# EAGLE design 0129-codec-mp3 (EAGLE 9.6.2)
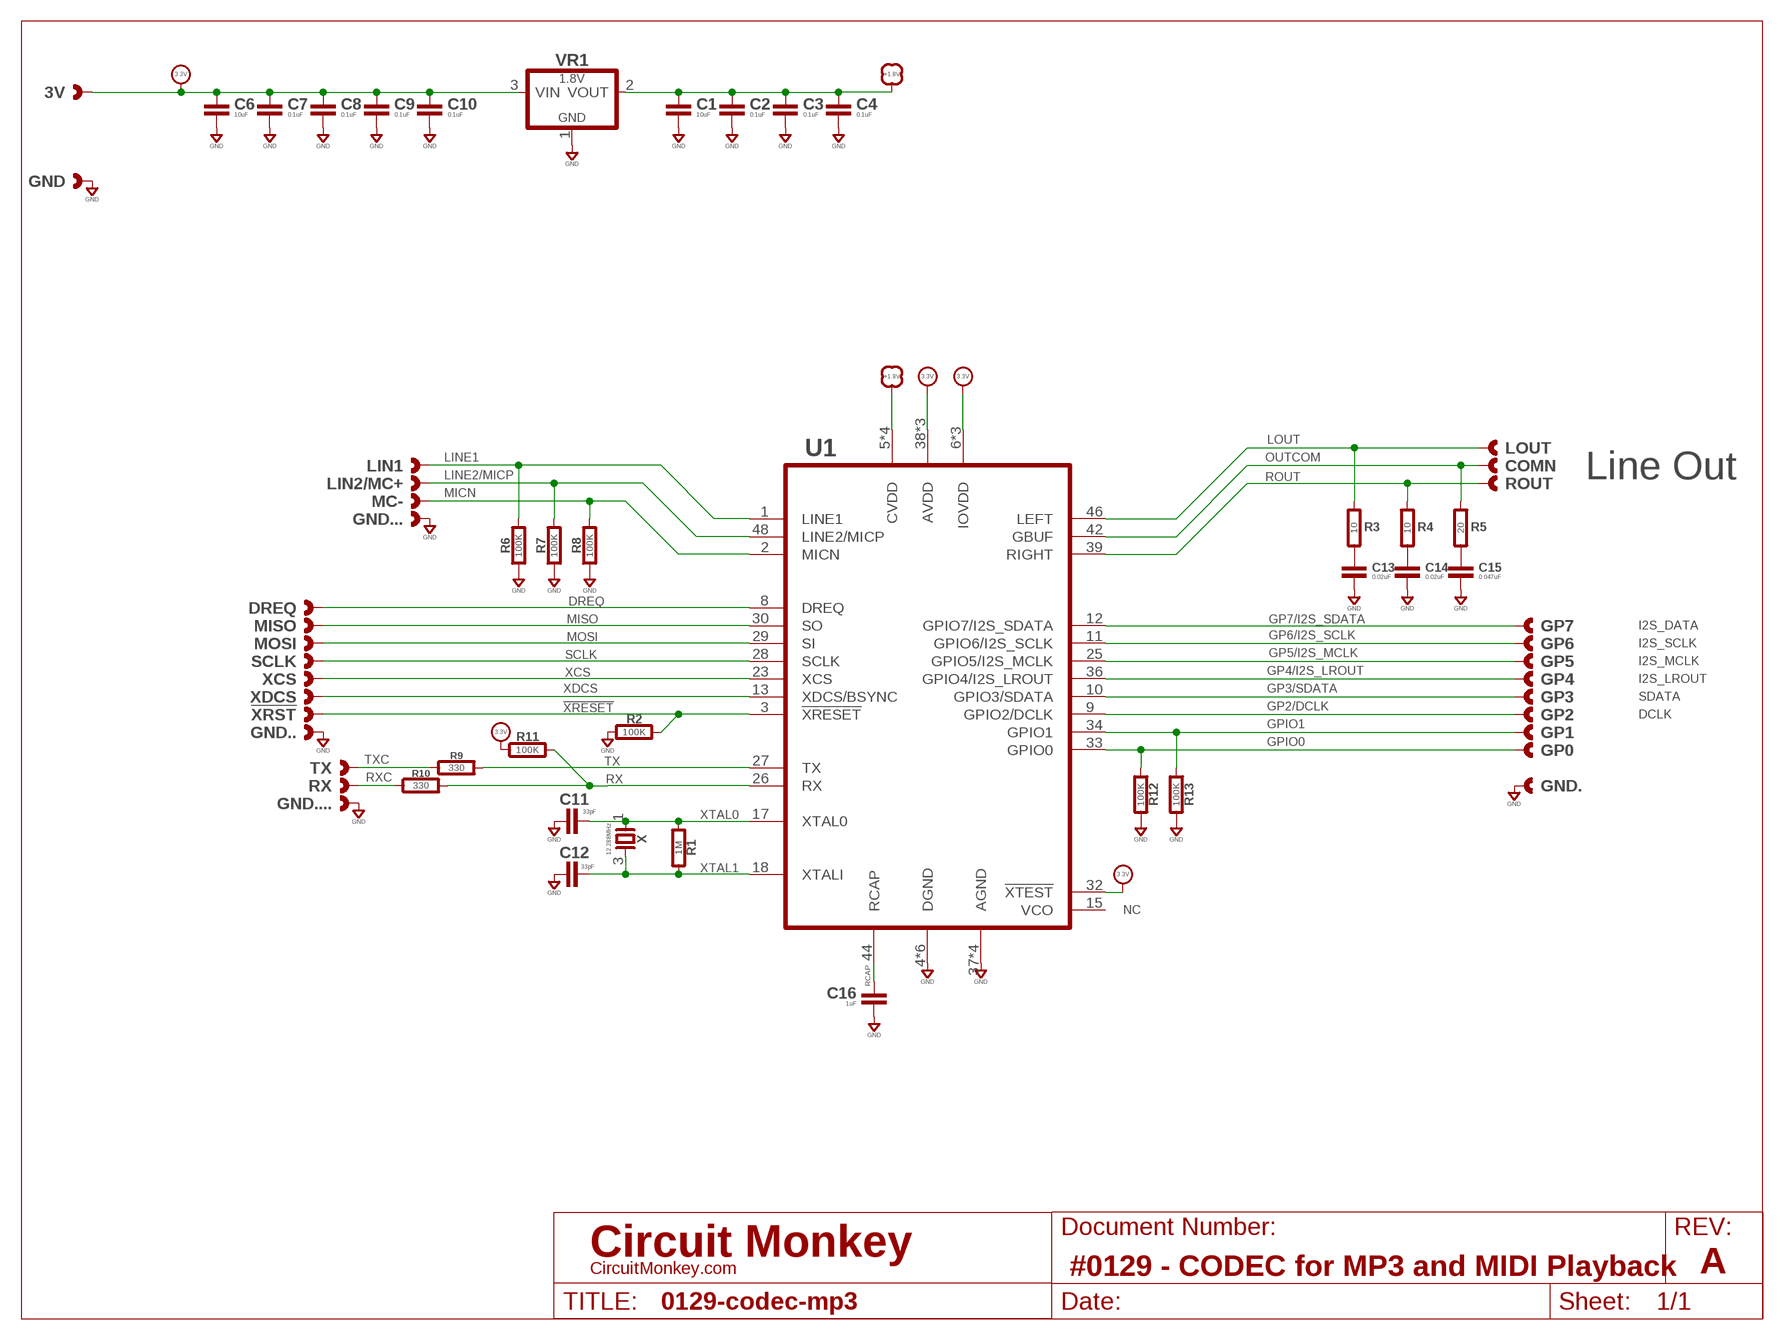
[diagram p0: schematic, sheet 1]
SHEET1 (LETTER_L-CIRCUITMONKEY): DOCUMENT_NUMBER: #0129 - CODEC for MP3 and MIDI Playback; REV: A

## Parts
3V  CAST-01X12.00MM  [CAST01-2.00MM]
!XRST  CAST-01X12.00MM  [CAST01-2.00MM]
C1  10uF  CAPACITOR0603  [0603-CAP]
C2  0.1uF  CAPACITOR0603  [0603-CAP]
C3  0.1uF  CAPACITOR0603  [0603-CAP]
C4  0.1uF  CAPACITOR0603  [0603-CAP]
C6  10uF  CAPACITOR0603  [0603-CAP]
C7  0.1uF  CAPACITOR0603  [0603-CAP]
C8  0.1uF  CAPACITOR0603  [0603-CAP]
C9  0.1uF  CAPACITOR0603  [0603-CAP]
C10  0.1uF  CAPACITOR0603  [0603-CAP]
C11  33pF  CAPACITOR0603  [0603-CAP]
C12  33pF  CAPACITOR0603  [0603-CAP]
C13  0.02uF  CAPACITOR0603  [0603-CAP]
C14  0.02uF  CAPACITOR0603  [0603-CAP]
C15  0.047uF  CAPACITOR0603  [0603-CAP]
C16  1uF  CAPACITOR0603  [0603-CAP]
COMN  CAST-01X12.00MM  [CAST01-2.00MM]
DREQ  CAST-01X12.00MM  [CAST01-2.00MM]
GND  CAST-01X12.00MM  [CAST01-2.00MM]
GND.  CAST-01X12.00MM  [CAST01-2.00MM]
GND..  CAST-01X12.00MM  [CAST01-2.00MM]
GND...  CAST-01X12.00MM  [CAST01-2.00MM]
GND....  CAST-01X12.00MM  [CAST01-2.00MM]
GP0  CAST-01X12.00MM  [CAST01-2.00MM]
GP1  CAST-01X12.00MM  [CAST01-2.00MM]
GP2  CAST-01X12.00MM  [CAST01-2.00MM]
GP3  CAST-01X12.00MM  [CAST01-2.00MM]
GP4  CAST-01X12.00MM  [CAST01-2.00MM]
GP5  CAST-01X12.00MM  [CAST01-2.00MM]
GP6  CAST-01X12.00MM  [CAST01-2.00MM]
GP7  CAST-01X12.00MM  [CAST01-2.00MM]
LIN1  CAST-01X12.00MM  [CAST01-2.00MM]
LIN2/MC+  CAST-01X12.00MM  [CAST01-2.00MM]
LOUT  CAST-01X12.00MM  [CAST01-2.00MM]
MC-  CAST-01X12.00MM  [CAST01-2.00MM]
MISO  CAST-01X12.00MM  [CAST01-2.00MM]
MOSI  CAST-01X12.00MM  [CAST01-2.00MM]
R1  1M  RESISTOR0603  [0603-RES]
R2  100K  RESISTOR0603  [0603-RES]
R3  10  RESISTOR0603  [0603-RES]
R4  10  RESISTOR0603  [0603-RES]
R5  20  RESISTOR0603  [0603-RES]
R6  100K  RESISTOR0603  [0603-RES]
R7  100K  RESISTOR0603  [0603-RES]
R8  100K  RESISTOR0603  [0603-RES]
R9  330  RESISTOR0603  [0603-RES]
R10  330  RESISTOR0603  [0603-RES]
R11  100K  RESISTOR0603  [0603-RES]
R12  100K  RESISTOR0603  [0603-RES]
R13  100K  RESISTOR0603  [0603-RES]
ROUT  CAST-01X12.00MM  [CAST01-2.00MM]
RX  CAST-01X12.00MM  [CAST01-2.00MM]
SCLK  CAST-01X12.00MM  [CAST01-2.00MM]
TX  CAST-01X12.00MM  [CAST01-2.00MM]
U1  CODEC-VS1053  [LQFP-48]
VR1  1.8V  LDO-3P--1.8V-SOT23  [SOT-23]
X  12.288MHz  2P32X25-12.288MHZ  [32X25]
XCS  CAST-01X12.00MM  [CAST01-2.00MM]
XDCS  CAST-01X12.00MM  [CAST01-2.00MM]

## Nets
!XRESET: !XRST.1 !XRST.P$1 !XRST.P$2 R2.2 U1.3(!XRESET)
+1.8V: C1.1 C2.1 C3.1 C4.1 U1.5(CVDD) U1.7(CVDD) U1.24(CVDD) U1.31(CVDD) VR1.2(VOUT)
+3.3V: 3V.1 3V.P$1 3V.P$2 C6.1 C7.1 C8.1 C9.1 C10.1 R11.1 U1.6(IOVDD) U1.14(IOVDD) U1.19(IOVDD) U1.32(!XTEST) U1.38(AVDD) U1.43(AVDD) U1.45(AVDD) VR1.3(VIN) ; supply symbol labelled 3.3V
DREQ: DREQ.1 DREQ.P$1 DREQ.P$2 U1.8(DREQ)
GND: C1.2 C2.2 C3.2 C4.2 C6.2 C7.2 C8.2 C9.2 C10.2 C11.1 C12.1 C13.2 C14.2 C15.2 C16.2 GND.1 GND..1 GND...1 GND....1 GND.....1 GND.....P$1 GND.....P$2 GND....P$1 GND....P$2 GND...P$1 GND...P$2 GND..P$1 GND..P$2 GND.P$1 GND.P$2 R2.1 R6.1 R7.1 R8.1 R12.2 R13.2 U1.4(DGND) U1.16(DGND) U1.20(DGND) U1.21(DGND) U1.22(DGND) U1.35(DGND) U1.37(AGND) U1.40(AGND) U1.41(AGND) U1.47(AGND) VR1.1(GND)
GP2/DCLK: GP2.1 GP2.P$1 GP2.P$2 U1.9(GPIO2/DCLK)
GP3/SDATA: GP3.1 GP3.P$1 GP3.P$2 U1.10(GPIO3/SDATA)
GP4/I2S_LROUT: GP4.1 GP4.P$1 GP4.P$2 U1.36(GPIO4/I2S_LROUT)
GP5/I2S_MCLK: GP5.1 GP5.P$1 GP5.P$2 U1.25(GPIO5/I2S_MCLK)
GP6/I2S_SCLK: GP6.1 GP6.P$1 GP6.P$2 U1.11(GPIO6/I2S_SCLK)
GP7/I2S_SDATA: GP7.1 GP7.P$1 GP7.P$2 U1.12(GPIO7/I2S_SDATA)
GPIO0: GP0.1 GP0.P$1 GP0.P$2 R12.1 U1.33(GPIO0)
GPIO1: GP1.1 GP1.P$1 GP1.P$2 R13.1 U1.34(GPIO1)
LINE1: LIN1.1 LIN1.P$1 LIN1.P$2 R6.2 U1.1(LINE1)
LINE2/MICP: LIN2/MC+.1 LIN2/MC+.P$1 LIN2/MC+.P$2 R7.2 U1.48(LINE2/MICP)
LOUT: LOUT.1 LOUT.P$1 LOUT.P$2 R3.1 U1.46(LEFT)
MICN: MC-.1 MC-.P$1 MC-.P$2 R8.2 U1.2(MICN)
MISO: MISO.1 MISO.P$1 MISO.P$2 U1.30(SO)
MOSI: MOSI.1 MOSI.P$1 MOSI.P$2 U1.29(SI)
N$3: C13.1 R3.2
N$4: C14.1 R4.2
N$5: C15.1 R5.2
OUTCOM: COMN.1 COMN.P$1 COMN.P$2 R5.1 U1.42(GBUF)
RCAP: C16.1 U1.44(RCAP)
ROUT: R4.1 ROUT.1 ROUT.P$1 ROUT.P$2 U1.39(RIGHT)
RX: R10.2 R11.2 U1.26(RX)
RXC: R10.1 RX.1 RX.P$1 RX.P$2
SCLK: SCLK.1 SCLK.P$1 SCLK.P$2 U1.28(SCLK)
TX: R9.2 U1.27(TX)
TXC: R9.1 TX.1 TX.P$1 TX.P$2
XCS: U1.23(XCS) XCS.1 XCS.P$1 XCS.P$2
XDCS: U1.13(XDCS/BSYNC) XDCS.1 XDCS.P$1 XDCS.P$2
XTAL0: C11.2 R1.1 U1.17(XTAL0) X.1
XTAL1: C12.2 R1.2 U1.18(XTALI) X.3
Unconnected: U1.15(VCO)

## Notes on the sheet
- Line Out
- I2S_DATA
- I2S_SCLK
- I2S_MCLK
- I2S_LROUT
- SDATA
- DCLK
- NC

## Library data of the parts
3V !XRST COMN DREQ GND GND. GND.. GND... GND.... GP0 GP1-GP7 LIN1 LIN2/MC+ LOUT MC- MISO MOSI ROUT RX SCLK TX XCS XDCS = con-headers:CAST-01X1: Castelated Edge Hole Pad
C1-C4 C6-C16 = rlc:CAPACITOR: Capacitor; COST01: 0.12; COST10: 0.09; COST100: 0.05
R1-R13 = rlc:RESISTOR: Resistor; COST01: 0.10; COST10: 0.05; COST100: 0.02
U1 = audio:CODEC-VS1053: VLSI CODEC for OGG,WAV,MP3 Recording/Playback, MIDI Sound Gen. I2S Capable
VR1 = regulators:LDO-3P-: regulator 3-pin; COST01: 0.40; COST10: 0.30; COST100: 0.15; MFR: Diodes, Inc.; MPN: AP2120N-1.8
X = xtal:2P: Crystal; COST01: 0.70; COST10: 0.57; COST100: 0.54; MPN: ABM8G-12.2-18D2Y

## Board
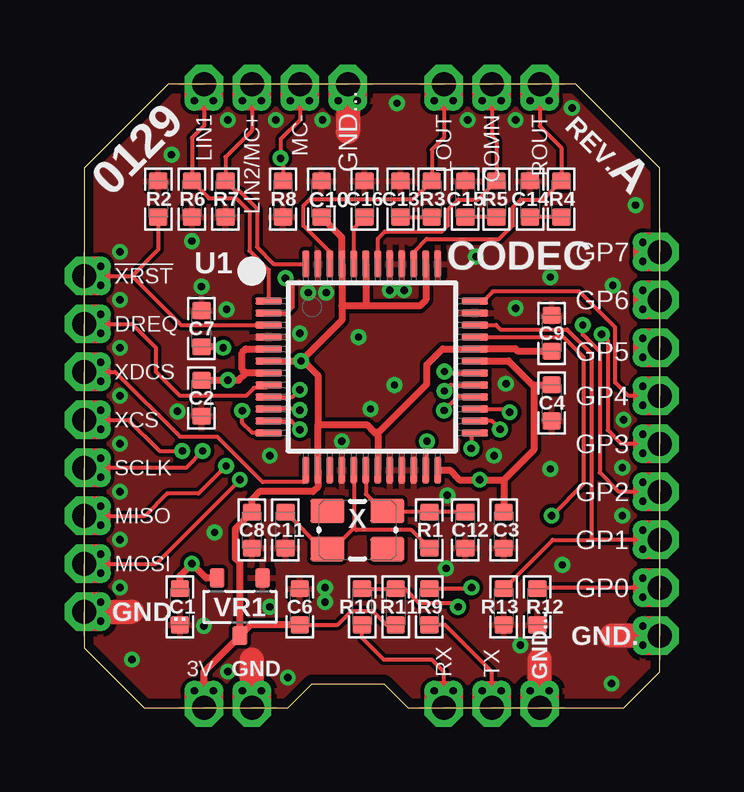
[diagram p1: board, top side]
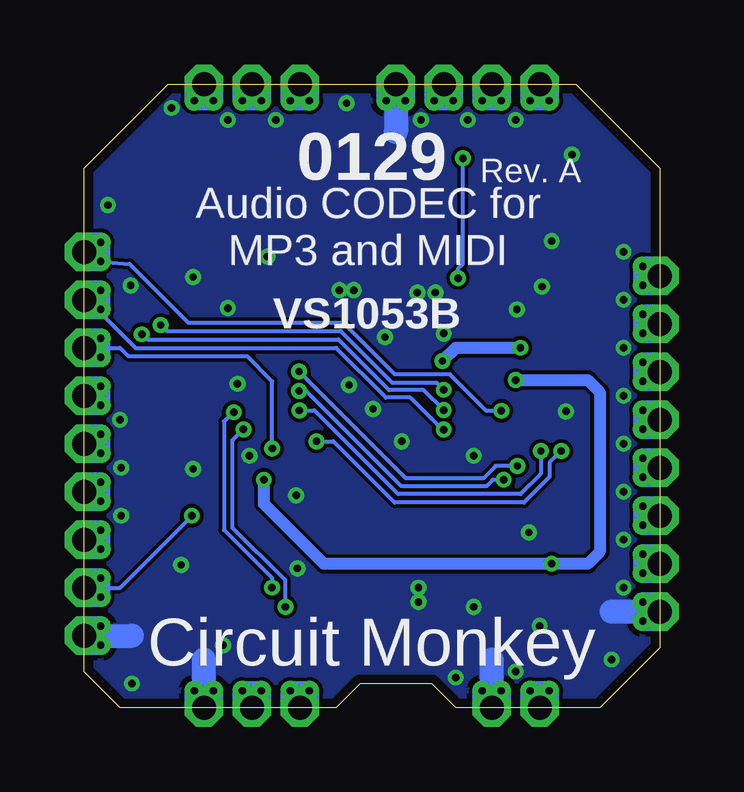
[diagram p2: board, bottom side, seen from below]

Size 24 x 26 mm. Coordinates in mm from the lower left corner, seen from the top.
Outline: 2.5,0 8.5,0 9.5,1 12.5,1 13.5,0 22.5,0 24,1.5 24,22.5 20.5,26 3.5,26 0,22.5 0,2.5 2.5,0
Copper layers (1*16): Top 0.0712mm / dielectric 0.657mm / Bottom 0.0712mm
Design rules "OSH-CircuitMonkey-thin": minimum track width 6mil, minimum drill 12mil, track to track 6mil, track to pad 6mil, pad to pad 6mil, via to via 6mil, smd to smd 6mil, copper to edge 15mil, drill to drill 6mil, minimum pad ring 7mil, minimum via ring 7mil, stop-mask expansion 3mil, vias tented up to drill 14mil, thermal gap 10mil

### Footprints (pad centres in the part's own frame; a part is rotated, then mirrored left to right if it is on the bottom)
CAST01-2.00MM = drill 1 pad 1.6 octagon: 1 0,0 | drill 0.305 pad 0.813: P$1 -0.7,0.4; P$2 -0.7,-0.4
0603-CAP = smd 0.711 x 0.762: 1 -0.752,0; 2 0.752,0
0603-RES = smd 0.711 x 0.762: 1 -0.752,0; 2 0.752,0
LQFP-48 = smd 1.1 x 0.3: 1 -4.3,2.75; 2 -4.3,2.25; 3 -4.3,1.75; 4 -4.3,1.25; 5 -4.3,0.75; 6 -4.3,0.25; 7 -4.3,-0.25; 8 -4.3,-0.75; 9 -4.3,-1.25; 10 -4.3,-1.75; 11 -4.3,-2.25; 12 -4.3,-2.75; 25 4.3,-2.75; 26 4.3,-2.25; 27 4.3,-1.75; 28 4.3,-1.25; 29 4.3,-0.75; 30 4.3,-0.25; 31 4.3,0.25; 32 4.3,0.75; 33 4.3,1.25; 34 4.3,1.75; 35 4.3,2.25; 36 4.3,2.75 | smd 0.3 x 1.1: 13 -2.75,-4.3; 14 -2.25,-4.3; 15 -1.75,-4.3; 16 -1.25,-4.3; 17 -0.75,-4.3; 18 -0.25,-4.3; 19 0.25,-4.3; 20 0.75,-4.3; 21 1.25,-4.3; 22 1.75,-4.3; 23 2.25,-4.3; 24 2.75,-4.3; 37 2.75,4.3; 38 2.25,4.3; 39 1.75,4.3; 40 1.25,4.3; 41 0.75,4.3; 42 0.25,4.3; 43 -0.25,4.3; 44 -0.75,4.3; 45 -1.25,4.3; 46 -1.75,4.3; 47 -2.25,4.3; 48 -2.75,4.3
SOT-23 = smd 0.6 x 0.8: 1 0.95,1.2; 2 -0.95,1.2; 3 0,-1.2
32X25 = smd 1.4 x 1: 1 -1.25,-0.8; 2 1.25,-0.8; 3 1.25,0.8; 4 -1.25,0.8

### Placement (x,y rotation side)
3V  5,0 270 top
!XRST  0,18 180 top
C1  4,4.2 270 top
C2  4.9,12.9 270 top
C3  17.5,7.4 270 top
C4  19.5,12.7 270 top
C6  9,4.2 90 top
C7  4.9,15.8 90 top
C8  7,7.4 270 top
C9  19.5,15.6 90 top
C10  9.9,21.2 90 top
C11  8.4,7.4 90 top
C12  15.9,7.4 90 top
C13  13.2,21.2 90 top
C14  18.6,21.2 90 top
C15  15.9,21.2 90 top
C16  11.7,21.2 90 top
COMN  17,26 90 top
DREQ  0,16 180 top
GND  7,0 270 top
GND.  24,3 0 top
GND..  0,4 180 top
GND...  11,26 90 top
GND....  19,0 270 top
GP0  24,5 0 top
GP1  24,7 0 top
GP2  24,9 0 top
GP3  24,11 0 top
GP4  24,13 0 top
GP5  24,15 0 top
GP6  24,17 0 top
GP7  24,19 0 top
LIN1  5,26 90 top
LIN2/MC+  7,26 90 top
LOUT  15,26 90 top
MC-  9,26 90 top
MISO  0,8 180 top
MOSI  0,6 180 top
R1  14.4,7.4 90 top
R2  3.1,21.2 270 top
R3  14.5,21.2 270 top
R4  19.9,21.2 270 top
R5  17.2,21.2 270 top
R6  4.5,21.2 90 top
R7  5.9,21.2 90 top
R8  8.3,21.2 90 top
R9  14.4,4.2 90 top
R10  11.6,4.2 90 top
R11  13,4.2 90 top
R12  18.9,4.2 270 top
R13  17.5,4.2 270 top
ROUT  19,26 90 top
RX  15,0 270 top
SCLK  0,10 180 top
TX  17,0 270 top
U1  12,14.2 0 top
VR1  6.5,4.2 0 top
X  11.4,7.4 0 top
XCS  0,12 180 top
XDCS  0,14 180 top

### Tracks (layer width: path | path; a pad name or v marks a point on that pad's centre or on a via)
!XRESET
  Top 0.16: U1.3 4.05,15.95 2,18 | 2,18 !XRST.1 0.2,18 | 0.2,18 !XRST.P$1 | 0.2,18 !XRST.P$2 | R2.2 3.1,19.1 2,18
+1.8V  (via drill 0.3)
  Top 0.3: U1.7 6.75,13.95 | 6.75,13.95 6.6,14.1 6.6,14.8 6.75,14.95 U1.5 | C2.1 v6,13.65 6.45,13.65 6.75,13.95 | VR1.2 5.1,5.4 v4.5,6 4,5.5 C1.1 | 17.5,9.5 C3.1 | U1.24 15.25,9.9 15.65,9.5 v16.5,9.5 17.5,9.5 | 18.75,13.45 18.7,13.45 17.7,14.45 U1.31 | 18.75,13.45 C4.1 | 17.5,9.5 18.75,10.75 18.75,13.45
  Bottom 0.5: v16.5,9.5 16.5,8.5 14,6 v4.5,6 3,6 2.5,6.5 2.5,13.15 3,13.65 v6,13.65
+3.3V  (via drill 0.3)
  Top 0.16: C6.1 10.58,3.45 11.16,4.04 12.04,4.04 12.62,3.45 R11.1
  Top 0.3: 9.75,11.8 U1.14 9.75,9.21 9.54,9 7.33,9 7,8.67 C8.1 6.32,7.47 6.32,6.21 6.5,6.03 VR1.3 | 9.75,11.8 11.8,11.8 12.1,11.5 | 12.1,11.5 12.25,11.35 U1.19 | U1.6 v9.05,14.45 | 9.75,11.8 9.75,13.85 9.15,14.45 v9.05,14.45 | C7.1 5.75,15.05 v5.8,15 | 10.75,16.75 U1.45 10.75,19.6 C10.1 | 10.75,16.75 10.75,16.15 v9.05,14.45 | 11.75,16.75 10.75,16.75 | 12.1,11.5 12.3,11.5 14.3,13.5 14.3,14.3 14.95,14.95 U1.32 17.99,14.95 18.09,14.85 C9.1 | U1.38 14.25,17 14,16.75 11.75,16.75 | U1.43 11.75,16.75 | VR1.3 5,1.5 3V.1 5,0.2 | 5,0.2 3V.P$1 | 5,0.2 3V.P$2 | C6.1 6.95,3.45 VR1.3
  Bottom 0.5: v5.8,15 8.5,15 v9.05,14.45
DREQ
  Top 0.16: U1.8 7.58,13.33 7.09,13.33 6.76,13 4,13 3,14 3,15 2,16 DREQ.1 0.2,16 | 0.2,16 DREQ.P$2 | 0.2,16 DREQ.P$1
GND  (via drill 0.3)
  Top 0.16: GND.....1 19,0.2 GND.....P$1 GND.....P$2 | 7,0.2 GND.P$1 | GND.1 7,0.2 | 7,0.2 GND.P$2
  Top 1: GND.1 7,2 | GND.....1 19,2 | GND..1 22,3 | GND...1 2,4 | GND....1 11,24
  Bottom 0.16: 23.8,3 GND..P$1 | GND..1 23.8,3 | 23.8,3 GND..P$2 | GND...P$2 0.5,4.5 GND...1 0.5,3.5 GND...P$1 | GND....P$2 11.5,25.5 GND....1 11,25.8 GND....P$1
  Bottom 1: GND.1 7,2 | GND.....1 19,2 | GND..1 22,3 | GND...1 2,4 | GND....1 11,24
  other vias: 2,2 5.45,7.3 10.05,5 22,1 19.95,5.95 22.45,8 22.45,10 22.5,12 23,20.95 19.45,9.95 11.95,12.45 12.95,13.45 11.45,15.45 16.35,18.8 19.45,17.95 3.65,23.05 6,24.5 8,24.5 9.95,24.5 16,24.5 18,24.5 20.35,25 13.05,25.2 18,16.65 17.6,13.5 17.1,10.5 12.75,17.4 13.35,17.4 10.1,17.3 9.35,17.3 9,15.6 1.5,17 1.5,15 5.95,16.6 4.9,17.55 4.5,19.45 1.5,13 1.5,11 1.5,9 1.5,7 10.75,11.1 15.1,5.8 15.15,8.85 1.5,19 1.5,5 18.2,2.6 10.05,4.4 7.75,4.2 5,3.4 6,1.5 8.5,1.25 7.75,10.5 3.9,12.35 22.05,17.6
  pour Top: 2.5,0 0,2.5 0,22.5 3.5,26 20.5,26 24,22.5 24,1.5 22.5,0 13.5,0 12.5,1 9.5,1 8.5,0
  pour Bottom: 22.5,0 24,1.5 24,22.5 20.5,26 3.5,26 0,22.5 0,2.5 2.5,0 8.5,0 9.5,1 12.5,1 13.5,0
GP2/DCLK  (via drill 0.3)
  Top 0.16: U1.9 8.7,12.95 v9,13.25 | GP2.1 22.3,9 21.5,9.8 21.5,14.85 20.8,15.55 v20.8,15.95
  Bottom 0.16: v9,13.25 9.3,13.55 11.15,13.55 13.3,15.7 20.55,15.7 v20.8,15.95 | 23.8,9 GP2.P$1 | GP2.1 23.8,9 | 23.8,9 GP2.P$2
GP3/SDATA  (via drill 0.3)
  Top 0.16: U1.10 8.95,12.45 v9,12.4 | GP3.1 22.4,11 21.84,11.56 21.84,15.31 v21.59,15.56
  Bottom 0.16: 23.8,11 GP3.P$1 | GP3.1 23.8,11 | 23.8,11 GP3.P$2 | v9,12.4 9.84,13.24 11.28,13.24 13.39,15.35 21.38,15.35 v21.59,15.56
GP4/I2S_LROUT
  Top 0.16: U1.36 16.65,16.95 17.05,17.35 20.65,17.35 22.15,15.85 22.15,13.55 22.7,13 GP4.1
  Bottom 0.16: 23.8,13 GP4.P$1 | GP4.1 23.8,13 | 23.8,13 GP4.P$2
GP5/I2S_MCLK  (via drill 0.3)
  Top 0.16: U1.25 16.15,11.3 v16.15,10.8
  Bottom 0.16: v16.15,10.8 16.15,13.6 17.2,14.65 22.15,14.65 22.5,15 GP5.1 23.8,15 | 23.8,15 GP5.P$1 | 23.8,15 GP5.P$2
GP6/I2S_SCLK  (via drill 0.3)
  Top 0.16: U1.11 8.64,11.95 v9,11.59
  Bottom 0.16: 23.8,17 GP6.P$1 | 23.8,17 GP6.1 23.85,17 21.85,15 13.48,15 11.41,12.93 10.39,12.93 9.05,11.59 v9,11.59 | 23.8,17 GP6.P$2
GP7/I2S_SDATA  (via drill 0.3)
  Top 0.16: U1.12 7.02,11.45 6.6,11.87 v6.6,12.37
  Bottom 0.16: 23.8,19 GP7.P$2 22.1,18.5 19.65,16.05 13.2,16.05 11.03,13.89 8.74,13.89 7.22,12.37 v6.6,12.37 | GP7.1 23.8,19 | 23.8,19 GP7.P$1
GPIO0  (via drill 0.3)
  Top 0.16: R12.1 18.95,5 GP0.1 23.8,5 | 23.8,5 GP0.P$1 | 23.8,5 GP0.P$2 | v19.5,8 20.84,9.34 20.84,14.6 19.99,15.45 U1.33
  Bottom 0.16: GP0.1 22.5,5 v19.5,8
GPIO1
  Top 0.16: R13.1 19.55,7 21.15,7 | 21.15,7 GP1.1 23.8,7 | 23.8,7 GP1.P$1 | 23.8,7 GP1.P$2 | U1.34 17.18,15.95 17.36,15.76 20.14,15.76 21.15,14.75 21.15,7
LINE1
  Top 0.16: U1.1 7.7,18.25 6.9,19.05 6.9,20.67 6.34,21.24 5.22,21.24 R6.2 4.5,23.75 5,24.25 LIN1.1 5,25.8 | 5,25.8 LIN1.P$2 | 5,25.8 LIN1.P$1
LINE2/MICP
  Top 0.16: U1.48 7.91,18.5 7.21,19.2 7.21,20.8 6.46,21.55 6.3,21.55 R7.2 5.9,22.95 7,24.05 LIN2/MC+.1 7,25.8 | 7,25.8 LIN2/MC+.P$2 | 7,25.8 LIN2/MC+.P$1
LOUT
  Top 0.16: U1.46 10.25,18.99 9.15,20.09 9.15,20.92 9.43,21.2 13.75,21.2 R3.1 14.5,23.25 15,23.75 LOUT.1 15,25.8 | 15,25.8 LOUT.P$2 | 15,25.8 LOUT.P$1
MICN  (via drill 0.3)
  Top 0.16: U1.2 8.45,16.45 8.7,16.7 8.7,17.6 v8.4,17.9 | R8.2 8.3,22.8 v8.2,22.9 8.2,23.7 9,24.5 MC-.1 9,25.8 | 9,25.8 MC-.P$1 | 9,25.8 MC-.P$2
  Bottom 0.16: v8.4,17.9 8.4,18.3 8.2,18.5 v8.2,22.9
MISO  (via drill 0.3)
  Top 0.16: v5.92,10.07 4.78,8.93 3.48,8.93 2.55,8 MISO.1 | v15.03,14.01 15.1,13.95 U1.30 | MISO.1 0.2,8 MISO.P$2 | MISO.1 0.5,7.5 MISO.P$1
  Bottom 0.16: v5.92,10.07 6.83,10.07 7.33,9.57 10.6,9.57 v15.03,14.01
MOSI  (via drill 0.3)
  Top 0.16: MOSI.1 3,6 v6.5,9.5 | v15.03,13.2 15.28,13.45 U1.29 | MOSI.1 0.5,6.5 MOSI.P$2 | MOSI.1 0.2,6 MOSI.P$1
  Bottom 0.16: v6.5,9.5 6.95,9.5 7.2,9.25 10.78,9.25 14.73,13.2 v15.03,13.2
N$3
  Top 0.16: C13.1 R3.2
N$4
  Top 0.16: R4.2 C14.1
N$5
  Top 0.16: R5.2 C15.1
OUTCOM
  Top 0.16: U1.42 12.25,19.54 12.55,19.84 14.92,19.84 15.19,20.11 15.19,20.76 15.61,21.19 16.43,21.19 R5.1 17.2,23.65 17,23.85 COMN.1 | COMN.1 17,25.8 COMN.P$2 | COMN.1 16.5,25.5 COMN.P$1
RCAP
  Top 0.16: U1.44 11.25,20 C16.1
ROUT
  Top 0.16: R4.1 19.13,21.19 18.21,21.19 17.89,20.86 17.89,20.11 17.31,19.53 14.29,19.53 13.75,18.99 U1.39 | R4.1 | ROUT.1 19,24.25 19.9,23.35 R4.1 | ROUT.1 19.5,25.5 ROUT.P$2 | ROUT.1 18.5,25.5 ROUT.P$1
RX  (via drill 0.3)
  Top 0.16: R10.2 R11.2 13.38,4.95 13.96,4.36 15.44,4.36 v15.6,4.2 | v17.35,11.6 17,11.95 U1.26
  Bottom 0.16: v15.6,4.2 15.6,5.3 17.81,7.52 17.81,11.14 v17.35,11.6
RXC
  Top 0.16: RX.1 15,1.5 14.5,2 12.5,2 11.6,2.9 R10.1 | RX.1 14.5,0.5 RX.P$2 | RX.1 15,0.2 RX.P$1
SCLK  (via drill 0.3)
  Top 0.16: v4.95,10.7 4.25,10 SCLK.1 | U1.28 15.58,12.95 v15.02,12.39 | SCLK.1 0.2,10 SCLK.P$2 | SCLK.1 0.5,9.5 SCLK.P$1
  Bottom 0.16: v4.95,10.7 4.95,9.75 5.8,8.9 10.9,8.9 14.39,12.39 v15.02,12.39
TX  (via drill 0.3)
  Top 0.16: U1.27 17.61,12.45 v17.75,12.31 | v16.16,5 16.11,4.95 R9.2
  Bottom 0.16: v17.75,12.31 17.78,12.31 18.16,11.93 18.16,7.4 16.16,5.4 v16.16,5
TXC
  Top 0.16: R9.1 15.05,3.45 17,1.5 TX.1 17,0.2 | 17,0.2 TX.P$2 | 17,0.2 TX.P$1
XCS  (via drill 0.3)
  Top 0.16: XCS.1 1.85,12 3.15,10.7 v4.1,10.7 | v14.3,11.1 14.25,11.05 U1.23 | XCS.1 0.5,12.5 XCS.P$2 | XCS.1 0.5,11.5 XCS.P$1
  Bottom 0.16: v4.1,10.7 4.59,10.21 4.59,9.62 5.65,8.55 11.05,8.55 13.6,11.1 v14.3,11.1
XDCS
  Top 0.16: XDCS.1 1.3,14 4,11.3 5.56,11.3 7.46,9.4 9.15,9.4 9.25,9.5 U1.13 | XDCS.1 0.5,14.5 XDCS.P$2 | XDCS.1 0.5,13.5 XDCS.P$1
XTAL0
  Top 0.16: U1.17 11.25,7.5 | 11.25,7.5 10.35,6.6 X.1 9.95,6.6 C11.2 | R1.1 13.65,7.4 11.35,7.4 11.25,7.5
XTAL1
  Top 0.16: U1.18 11.75,8.9 12.45,8.2 X.3 12.7,8.15 R1.2 C12.2

### Text on the board
tPlace: 0129 | REV. | A | CODEC
bPlace: 0129 | Rev. A | Audio CODEC for / MP3 and MIDI | VS1053B | Circuit Monkey